# Altium schematic sheet 9-ZIGBEE.SchDoc: RD15002_SingleSCT.PrjPcb
size A4; DrawnBy: 邓勇杰; Revision: A1.0.0; SheetNumber: 10; SheetTotal: 10; Time: 2015/12/2
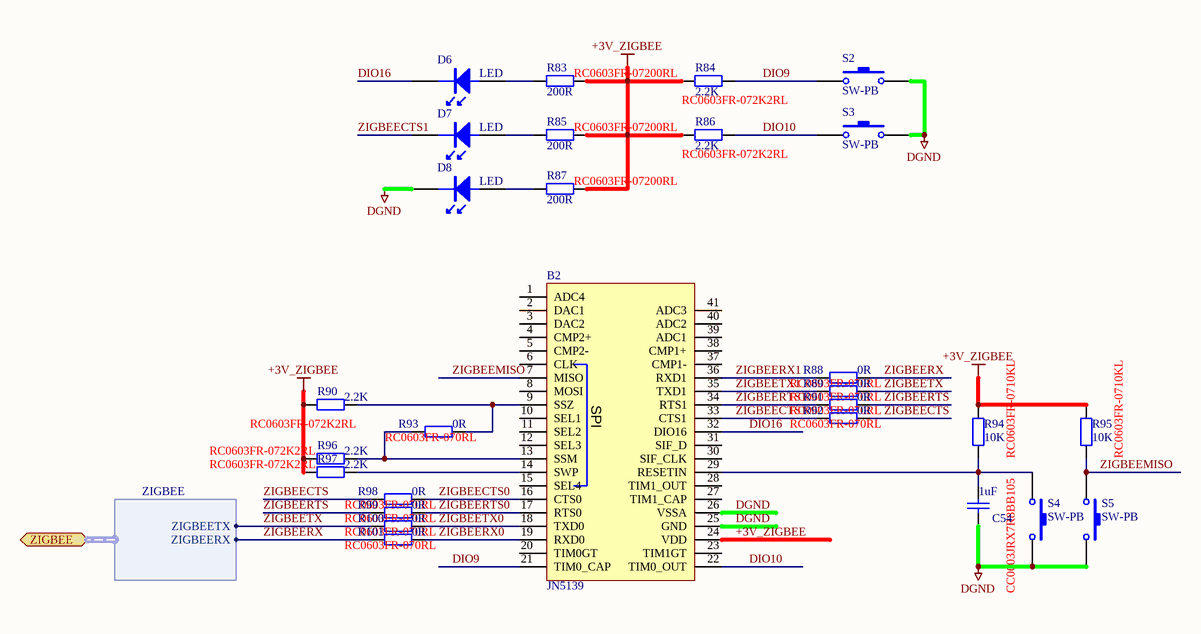
[diagram p0: 9-ZIGBEE.SchDoc]

## Parts
B2  JN5139  [JN5139]
C54  1uF  Type No.: CC0603JRX7R8BB105  [CC0603]
D6  LED  [D0603]
D7  LED  [D0603]
D8  LED  [D0603]
R83  200R  Type No.: RC0603FR-07200RL  [CC0603]
R84  2.2K  Type No.: RC0603FR-072K2RL  [CC0603]
R85  200R  Type No.: RC0603FR-07200RL  [CC0603]
R86  2.2K  Type No.: RC0603FR-072K2RL  [CC0603]
R87  200R  Type No.: RC0603FR-07200RL  [CC0603]
R88  0R  Type No.: RC0603FR-070RL  [CC0603]
R89  0R  Type No.: RC0603FR-070RL  [CC0603]
R90  2.2K  Type No.: RC0603FR-072K2RL  [CC0603]
R91  0R  Type No.: RC0603FR-070RL  [CC0603]
R92  0R  Type No.: RC0603FR-070RL  [CC0603]
R93  0R  Type No.: RC0603FR-070RL  [CC0603]
R94  10K  Type No.: RC0603FR-0710KL  [CC0603]
R95  10K  Type No.: RC0603FR-0710KL  [CC0603]
R96  2.2K  Type No.: RC0603FR-072K2RL  [CC0603]
R97  2.2K  Type No.: RC0603FR-072K2RL  [CC0603]
R98  0R  Type No.: RC0603FR-070RL  [CC0603]
R99  0R  Type No.: RC0603FR-070RL  [CC0603]
R100  0R  Type No.: RC0603FR-070RL  [CC0603]
R101  0R  Type No.: RC0603FR-070RL  [CC0603]
S2  SW-PB  [SPST]
S3  SW-PB  [SPST]
S4  SW-PB  [SPST]
S5  SW-PB  [SPST]

## Ports
ZIGBEE (harness ZIGBEE)

## Harnesses
ZIGBEE: ZIGBEETX, ZIGBEERX

## Nets
+3V_ZIGBEE: B2.24(VDD) R83.2 R84.1 R85.2 R86.1 R87.2 R90.1 R94.1 R95.1 R96.1 R97.1
DGND: B2.25(GND) B2.26(VSSA) C54.1 D8.2(K) S2.2 S3.2 S4.2 S5.2
DIO9: B2.21(TIM0_CAP) R84.2 S2.1
DIO10: B2.22(TIM0_OUT) R86.2 S3.1
DIO16: B2.32(DIO16) D6.2(K)
ZIGBEECTS: R92.1 R98.2
ZIGBEECTS0: B2.16(CTS0) R98.1
ZIGBEECTS1: B2.33(CTS1) D7.2(K) R92.2
ZIGBEEMISO: B2.7(MISO) R95.2 S5.1
ZIGBEERTS: R91.1 R99.2
ZIGBEERTS0: B2.17(RTS0) R99.1
ZIGBEERTS1: B2.34(RTS1) R91.2
ZIGBEERX: R88.1 R101.2 ; port ZIGBEE.ZIGBEERX
ZIGBEERX0: B2.19(RXD0) R101.1
ZIGBEERX1: B2.36(RXD1) R88.2
ZIGBEETX: R89.1 R100.2 ; port ZIGBEE.ZIGBEETX
ZIGBEETX0: B2.18(TXD0) R100.1
ZIGBEETX1: B2.35(TXD1) R89.2
NetB2_9: B2.9(SSZ) R90.2 R93.1
NetB2_13: B2.13(SSM) R93.2 R96.2
NetB2_14: B2.14(SWP) R97.2
NetB2_29: B2.29(RESETIN) C54.2 R94.2 S4.1
NetD6_1: D6.1(A) R83.1
NetD7_1: D7.1(A) R85.1
NetD8_1: D8.1(A) R87.1

Not connected (* = marked no-connect by the designer): B2 1(ADC4) 2(DAC1) 3(DAC2) 4(CMP2+) 5(CMP2-) 6(CLK) 8(MOSI) 10(SEL1) 11(SEL2) 12(SEL3) 15(SEL4) 20(TIM0GT) 23(TIM1GT) 27(TIM1_CAP) 28(TIM1_OUT) 30(SIF_CLK) 31(SIF_D) 37(CMP1-) 38(CMP1+) 39(ADC1) 40(ADC2) 41(ADC3)

## Notes on the sheet
- 文件版本:
- 原理图名:
- 工 程  名:
- 绘       制:
- 审       核:
- 第   页，共    页
- 日       期:
- (in symbol JN5139) SPI

## Library data of the parts
C54 = Cap: Capacitor
R83-R101 = Res2: Resistor
S2-S5 = SW-PB: Switch; Published: 24-Mar-1999; LatestRevisionDate: 17-Jul-2002; LatestRevisionNote: Re-released for DXP Platform.; PackageReference: SPST-2; Publisher: Altium Limited